# EasyEDA Pro project 步进电机驱动器.eprj, board PCB1.1.2
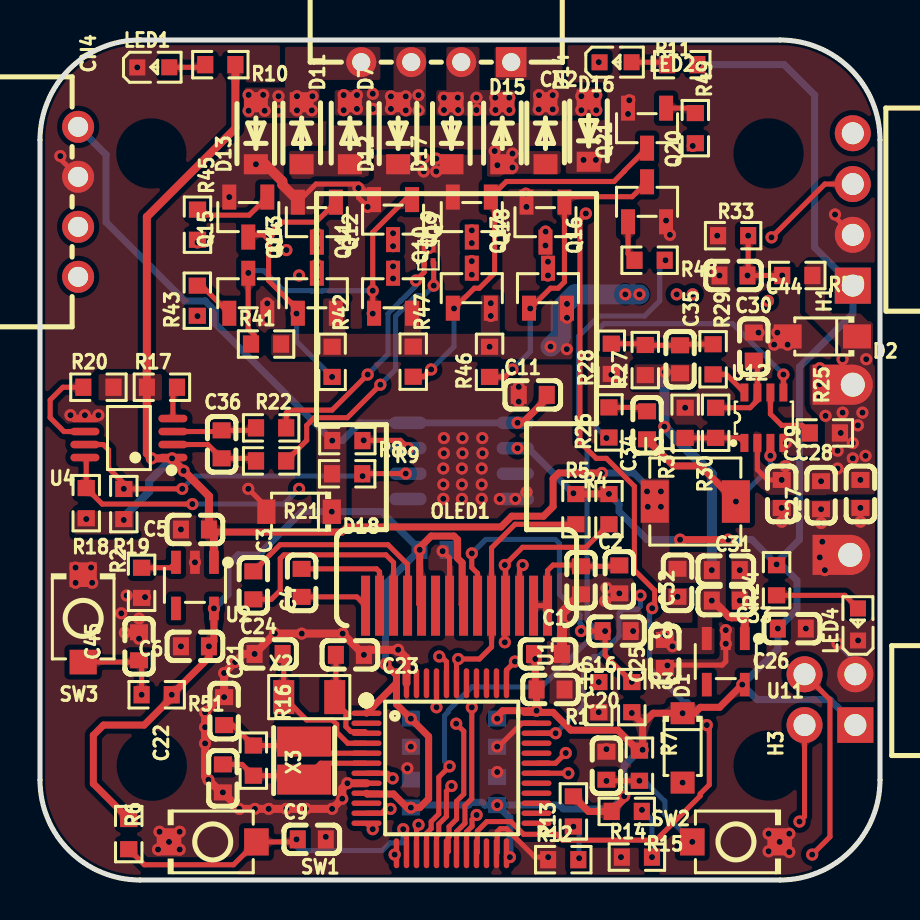
[diagram p4: board, top side]
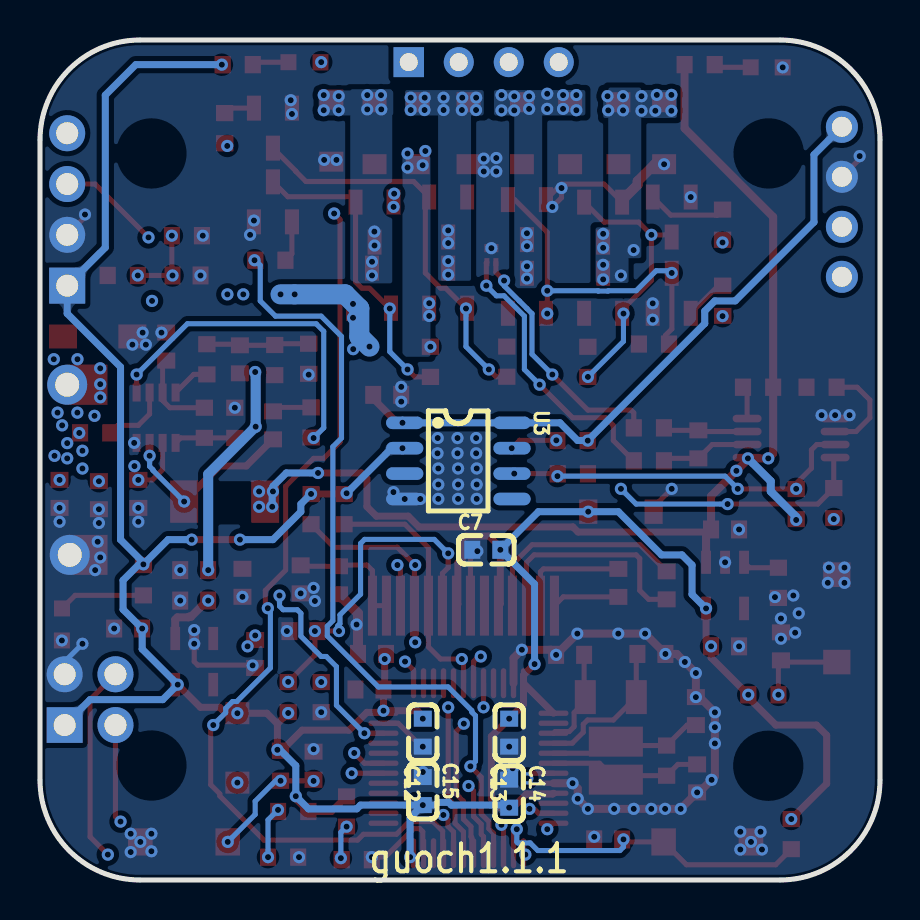
[diagram p5: board, bottom side, seen from below]

Outline 42 x 42 mm; copper layers: Top Layer, Inner1, Inner2, Bottom Layer. Coordinates in mm from the lower left corner of the outline.
Outline path: 0,37 0,5 arc(1.46,1.46) 5,0 37,0 arc(40.54,1.46) 42,5 42,37 arc(40.54,40.54) 37,42 5,42 arc(1.46,40.54) 0,37
Stack: Top Layer 0.035mm 外层铜厚1oz / Dielectric1 0.2104mm 7628 RC49% 8.6mil / Inner1 0.0152mm 内层铜厚 / Dielectric2 1.065mm 1.1mm H/HOZ Copper / Inner2 0.0152mm 内层铜厚 / Dielectric3 0.2104mm 7628 RC49% 8.6mil / Bottom Layer 0.035mm 外层铜厚1oz

## Design rules (mm)
template: 自定义配置
spacing copperThickness1oz (default): track to track 0.102, other pairs 0.152 to 0.3
spacing copperThickness2oz: track to track 0.203, other pairs 0.152 to 0.3
track width copperThickness1oz (default): min 0.127, default 0.254, max 2.54
track width copperThickness2oz: min 0.203, default 0.254, max 2.54
differential pair differentialPair (default): width min 0.127, default 0.254, max 2.54; gap min 0.152, default 0.152
via viaSize (default): diameter min 0.5, default 0.61, max 10; hole min 0.3, default 0.305, max 6.3

## Placement (name value [footprint] x y rotation side)
C1  4.7uF  [C0603]  27.05 14.99 90 top
C2  2.2uF  [C0603]  28.97 15.03 90 top
C3  1uF  [C0603]  10.67 14.73 270 top
C4  1uF  [C0603]  13.08 14.86 270 top
C5  1uF  [C0603]  7.75 17.53 0 top
C6  1uF  [C0603]  7.75 11.68 180 top
C7  1uF  [C0603]  19.69 16.51 180 bottom
C8  10uF  [C0603]  28.83 12.45 0 top
C9  100nF  [C0603]  13.59 2.03 0 top
C10  100nF  [C0603]  28.32 5.72 90 top
C11  1uF  [C0603]  24.64 24.26 0 top
C12  100nF  [C0603]  22.86 7.37 90 bottom
C13  100nF  [C0603]  18.54 7.37 90 bottom
C14  100nF  [C0603]  18.54 4.32 270 bottom
C15  100nF  [C0603]  22.86 4.44 270 bottom
C16  100nF  [C0603]  25.4 11.3 180 top
C20  100nF  [C0603]  25.53 9.53 180 top
C21  12pF  [C0603]  9.21 8.44 270 top
C22  12pF  [C0603]  9.14 5.08 90 top
C23  12pF  [C0603]  15.49 11.26 180 top
C24  12pF  [C0603]  11.43 11.3 0 top
C25  2.2uF  [C0603]  31.24 11.3 90 top
C26  2.2uF  [C0603]  37.59 12.57 180 top
C27  N/A  [C0603]  39.05 19.24 90 top
C28  22uf  [C0603]  41.02 19.3 270 top
C29  0.1uf  [C0603]  37.08 19.3 270 top
C30  0.1uf  [C0603]  35.69 26.67 270 top
C31  22uf  [C0603]  34.29 15.49 0 top
C32  22uf  [C0603]  31.88 14.86 270 top
C33  N/A  [C0603]  34.29 13.97 0 top
C34  0.1u  [C0603]  30.35 22.73 270 top
C35  33pf  [C0603]  32 26.03 270 top
C36  270pF  [C0603]  9.08 21.78 270 top
C44  100nF  [C0603]  34.67 30.23 180 top
C45  100nF  [C0603]  4.95 11.68 90 top
CN2  ZX-XH2.54-4PWZ  [CONN-TH_4P-P2.50_ZX-XH2.54-4PWZ]  19.81 40.89 180 top
CN4  WAFER-XH2.54-4PWZ-Y62  [CONN-TH_4P-P2.50_WAFER-XH2.54-4PWZ]  1.91 33.91 270 top
D1  1N4148W  [SOD-123_L2.7-W1.6-LS3.8-RD]  32.13 6.6 270 top
D2  SMF5.0A  [SOD-123FL_L2.7-W1.8-LS3.8-RD]  39.12 27.18 180 top
D7  PSBD1DF20V3H  [SOD-123F_L2.8-W1.8-LS3.7-RD]  15.49 37.34 270 top
D11  PSBD1DF20V3H  [SOD-123F_L2.8-W1.8-LS3.7-RD]  13.08 37.34 270 top
D12  PSBD1DF20V3H  [SOD-123F_L2.8-W1.8-LS3.7-RD]  17.91 37.34 90 top
D13  PSBD1DF20V3H  [SOD-123F_L2.8-W1.8-LS3.7-RD]  10.79 37.34 90 top
D14  PSBD1DF20V3H  [SOD-123F_L2.8-W1.8-LS3.7-RD]  25.27 37.34 270 top
D15  PSBD1DF20V3H  [SOD-123F_L2.8-W1.8-LS3.7-RD]  23.11 37.34 270 top
D16  PSBD1DF20V3H  [SOD-123F_L2.8-W1.8-LS3.7-RD]  27.43 37.47 90 top
D17  PSBD1DF20V3H  [SOD-123F_L2.8-W1.8-LS3.7-RD]  20.57 37.34 90 top
D18  MMSZ5233BT1G  [SOD-123_L2.7-W1.6-LS3.7-RD]  12.95 18.42 180 top
H1  PZ254R-11-04P  [HDR-TH_4P-P2.54-H-M-W10.4]  40.64 33.53 90 top
H3  PZ254R-12-4P  [HDR-TH_4P-P2.54-H-M-R2-C2-S2.54]  39.5 9.02 90 top
L2  4.7uH  [IND-SMD_L4.4-W4.2]  32.77 18.92 0 top
LED1  -  [LED_0603]  5.72 40.64 0 top
LED2  -  [LED_0603]  28.83 40.89 0 top
LED4  -  [LED_0603]  40.89 12.83 90 top
NOREF  -  [Pad_e104]  40.64 24.77 0 top
NOREF#2  -  [Pad_e107]  39.62 24.77 0 top
NOREF#3  -  [Pad_e106]  40.51 16.26 0 top
NOREF#4  -  [Pad_e108]  39.62 16.26 0 top
OLED1  X049-6432TSWPG02-H14  [OLED-SMD_X049-6432TSWPG02-H14]  20.83 13.72 0 top
Q9  MMBT3906LP  [X1-DFN1006-3_L1.0-W0.6-P0.35-BR]  19.43 31.24 270 top
Q10  BSS84  [SOT-23-3_L2.9-W1.3-P1.90-LS2.4-BR-1]  17.65 29.34 270 top
Q11  BSS84  [SOT-23-3_L2.9-W1.3-P1.90-LS2.4-BR-1]  13.84 29.34 270 top
Q12  2N7002  [SOT-23-3_L2.9-W1.3-P1.90-LS2.4-BR]  17.65 33.02 90 top
Q13  2N7002  [SOT-23-3_L2.9-W1.3-P1.90-LS2.4-BR]  13.84 32.89 90 top
Q14  2N7002  [SOT-23-3_L2.9-W1.3-P1.90-LS2.4-BR]  10.41 29.34 270 top
Q15  2N7002  [SOT-23-3_L2.9-W1.3-P1.90-LS2.4-BR]  10.41 33.15 90 top
Q16  BSS84  [SOT-23-3_L2.9-W1.3-P1.90-LS2.4-BR-1]  25.4 29.59 270 top
Q17  BSS84  [SOT-23-3_L2.9-W1.3-P1.90-LS2.4-BR-1]  21.59 29.59 270 top
Q18  2N7002  [SOT-23-3_L2.9-W1.3-P1.90-LS2.4-BR]  25.27 32.89 90 top
Q19  2N7002  [SOT-23-3_L2.9-W1.3-P1.90-LS2.4-BR]  21.59 33.15 90 top
Q20  2N7002  [SOT-23-3_L2.9-W1.3-P1.90-LS2.4-BR]  30.35 33.91 270 top
Q21  2N7002  [SOT-23-3_L2.9-W1.3-P1.90-LS2.4-BR]  30.35 37.59 90 top
R1  910K  [R0603]  27.94 9.14 90 top
R2  10K  [R0603]  5.08 14.86 90 top
R3  4.7K  [R0603]  29.59 9.14 270 top
R4  4.7K  [R0603]  28.45 18.54 270 top
R5  4.7K  [R0603]  26.8 18.54 270 top
R6  10K  [R0603]  4.44 2.29 270 top
R7  10K  [R0603]  29.97 5.72 270 top
R8  4.7K  [R0603]  15.37 21.97 180 top
R9  4.7K  [R0603]  15.36 20.31 180 top
R10  510R  [R0603]  9.02 40.77 180 top
R11  510R  [R0603]  32.11 40.77 180 top
R12  10K  [R0603]  26.16 1.02 0 top
R13  10K  [R0603]  26.67 3.43 90 top
R14  10K  [R0603]  29.84 1.14 0 top
R15  10K  [R0603]  29.34 3.43 180 top
R16  100M  [R0603]  10.67 5.97 90 top
R17  10K  [R0603]  6.1 24.64 0 top
R18  10K  [R0603]  2.31 18.84 270 top
R19  10K  [R0603]  4.19 18.8 270 top
R20  10K  [R0603]  2.92 24.64 0 top
R21  50  [R0603]  11.56 20.95 180 top
R22  50  [R0603]  11.56 22.61 180 top
R24  4.7K  [R0603]  36.83 14.99 90 top
R25  10K  [R0603]  39.24 22.35 180 top
R26  10R  [R0603]  28.45 22.88 90 top
R27  40.2K  [R0603]  30.26 26 90 top
R28  7.5K  [R0603]  28.57 26.06 90 top
R29  20K  [R0603]  33.66 26.03 270 top
R30  100K  [R0603]  33.78 22.86 90 top
R31  9.09K  [R0603]  32.26 22.86 90 top
R33  20kΩ  [R0603]  34.66 32.22 180 top
R41  10K  [R0603]  11.3 26.8 0 top
R42  10K  [R0603]  14.6 25.91 270 top
R43  1K  [R0603]  7.87 28.96 90 top
R45  1K  [R0603]  7.87 32.77 270 top
R46  10K  [R0603]  22.48 25.91 90 top
R47  10K  [R0603]  18.66 25.92 270 top
R48  1K  [R0603]  30.48 30.99 180 top
R49  1K  [R0603]  32.77 37.59 270 top
R50  200kΩ  [R0603]  37.86 30.23 180 top
R51  10K  [R0603]  5.83 9.26 180 top
SW1  TS-1088-AR02016  [SW-SMD_L3.9-W3.0-P4.45]  8.64 1.91 180 top
SW2  TS-1088-AR02016  [SW-SMD_L3.9-W3.0-P4.45]  34.8 1.91 0 top
SW3  TS-1088-AR02016  [SW-SMD_L3.9-W3.0-P4.45]  2.16 13.08 90 top
U1  STM32F103C8T6  [LQFP-48_L7.0-W7.0-P0.50-LS9.0-BL]  20.57 5.59 270 top
U2  RT9013-33GB  [SOT-23-5_L3.0-W1.7-P0.95-LS2.8-BL]  7.75 14.73 180 top
U3  MT6701CT-STD  [SOP-8_L4.9-W3.9-P1.27-LS6.0-BL]  21.08 20.95 270 bottom
U4  TMP411AQDGKRQ1  [VSSOP-8_L3.0-W3.0-P0.65-LS4.9-BL]  4.44 22.1 90 top
U11  RT9013-33GB  [SOT-23-5_L3.0-W1.7-P0.95-LS2.8-BL]  34.29 10.92 180 top
U12  MP2315SGJ-Z  [TSOT-23-8_L2.9-W1.6-P0.65-LS2.8-BL]  36.19 23.11 0 top
X2  32.768kHz  [CRYSTAL-SMD_L3.2-W1.5-1]  13.46 9.14 0 top
X3  8MHz  [OSC-SMD_2P-L3.2-W2.5]  13.21 5.97 270 top

## Footprints (pads in the part's own frame, mm; a bottom-side part is the same pattern mirrored in y, then rotated)
C0603
  rect 0.8x0.9 smd: 1(-0.7,0) 2(0.7,0)
CONN-TH_4P-P2.50_WAFER-XH2.54-4PWZ
  round 1.6 hole 1: 1(-3.75,0) 2(-1.25,0) 3(1.25,0) 4(3.75,0)
CONN-TH_4P-P2.50_ZX-XH2.54-4PWZ
  rect 1.524x1.5 hole 0.9: 1(-3.75,0)
  round 1.5 hole 0.9: 2(-1.25,0) 3(1.25,0) 4(3.75,0)
CRYSTAL-SMD_L3.2-W1.5-1
  rect 1.05x1.7 smd: 1(-1.275,0) 2(1.275,0)
HDR-TH_4P-P2.54-H-M-R2-C2-S2.54
  rect 1.778x1.8 hole 1.1: 1(-1.27,-1.27)
  round 1.8 hole 1.1: 2(-1.27,1.27) 3(1.27,-1.27) 4(1.27,1.27)
HDR-TH_4P-P2.54-H-M-W10.4
  rect 1.8x1.8 hole 1.1: 1(-3.81,0)
  round 1.8 hole 1.1: 2(-1.27,0) 3(1.27,0) 4(3.81,0)
IND-SMD_L4.4-W4.2
  rect 1.4x2.12 smd: 1(2.028,0) 2(-2.028,0)
LED_0603
  rect 0.8x0.8 smd: 1(-0.851,-0.01) 2(0.75,-0.005)
LQFP-48_L7.0-W7.0-P0.50-LS9.0-BL
  oval 0.27x1.5 smd: 1(-2.75,-4.25) 2(-2.25,-4.25) 3(-1.75,-4.25) 4(-1.25,-4.25) 5(-0.75,-4.25) 6(-0.25,-4.25) 7(0.25,-4.25) 8(0.75,-4.25) 9(1.25,-4.25) 10(1.75,-4.25) 11(2.25,-4.25) 12(2.75,-4.25) 25(2.75,4.25) 26(2.25,4.25) 27(1.75,4.25) 28(1.25,4.25) 29(0.75,4.25) 30(0.25,4.25) 31(-0.25,4.25) 32(-0.75,4.25) 33(-1.25,4.25) 34(-1.75,4.25) 35(-2.25,4.25) 36(-2.75,4.25)
  oval 1.5x0.27 smd: 13(4.25,-2.75) 14(4.25,-2.25) 15(4.25,-1.75) 16(4.25,-1.25) 17(4.25,-0.75) 18(4.25,-0.25) 19(4.25,0.25) 20(4.25,0.75) 21(4.25,1.25) 22(4.25,1.75) 23(4.25,2.25) 24(4.25,2.75) 37(-4.25,2.75) 38(-4.25,2.25) 39(-4.25,1.75) 40(-4.25,1.25) 41(-4.25,0.75) 42(-4.25,0.25) 43(-4.25,-0.25) 44(-4.25,-0.75) 45(-4.25,-1.25) 46(-4.25,-1.75) 47(-4.25,-2.25) 48(-4.25,-2.75)
OLED-SMD_X049-6432TSWPG02-H14
  rect 0.45x3 smd: 1(-4.55,0) 2(-3.85,0) 3(-3.15,0) 4(-2.45,0) 5(-1.75,0) 6(-1.05,0) 7(-0.35,0) 8(0.35,0) 9(1.05,0) 10(1.75,0) 11(2.45,0) 12(3.15,0) 13(3.85,0) 14(4.55,0)
OSC-SMD_2P-L3.2-W2.5
  rect 1.5x2.7 smd: 1(0.95,0) 2(-0.95,0)
Pad_e104
  round 2 hole 1.2: 1(0,0)
Pad_e106
  round 2 hole 1.2: 1(0,0)
Pad_e107
  rect 2x2 smd: 1(0,0)
Pad_e108
  rect 2x2 smd: 1(0,0)
R0603
  rect 0.806x0.864 smd: 1(-0.753,0) 2(0.753,0)
SOD-123_L2.7-W1.6-LS3.7-RD
  rect 0.91x1.22 smd: 1(-1.635,0) 2(1.635,0)
SOD-123_L2.7-W1.6-LS3.8-RD
  rect 1.1x1.2 smd: 1(-1.735,0) 2(1.735,0)
SOD-123F_L2.8-W1.8-LS3.7-RD
  rect 1x1.2 smd: 1(-1.55,0) 2(1.55,0)
SOD-123FL_L2.7-W1.8-LS3.8-RD
  rect 1.4x1.2 smd: 1(-1.735,0) 2(1.735,0)
SOP-8_L4.9-W3.9-P1.27-LS6.0-BL
  oval 0.63x1.865 smd: 1(-1.905,-2.683) 2(-0.635,-2.683) 3(0.635,-2.683) 4(1.905,-2.683) 5(1.905,2.683) 6(0.635,2.683) 7(-0.635,2.683) 8(-1.905,2.683)
SOT-23-3_L2.9-W1.3-P1.90-LS2.4-BR
  rect 1.25x0.7 smd: 1(1,-0.95) 2(1,0.95) 3(-1,0)
SOT-23-3_L2.9-W1.3-P1.90-LS2.4-BR-1
  rect 1.25x0.7 smd: 1(1,-0.95) 2(1,0.95) 3(-1,0)
SOT-23-5_L3.0-W1.7-P0.95-LS2.8-BL
  rect 0.49x1.157 smd: 1(-0.95,-1.153) 2(0,-1.153) 3(0.95,-1.153)
  rect 0.49x1.175 smd: 4(0.95,1.153) 5(-0.95,1.153)
SW-SMD_L3.9-W3.0-P4.45
  rect 1.23x1.36 smd: 1(-2.185,0) 2(2.185,0)
TSOT-23-8_L2.9-W1.6-P0.65-LS2.8-BL
  rect 0.4x0.9 smd: 1(-0.975,-1.26) 2(-0.325,-1.26) 3(0.325,-1.26) 4(0.975,-1.26) 5(0.975,1.26) 6(0.325,1.26) 7(-0.325,1.26) 8(-0.975,1.26)
VSSOP-8_L3.0-W3.0-P0.65-LS4.9-BL
  oval 0.38x1.45 smd: 1(-0.975,-2.2) 2(-0.325,-2.2) 3(0.325,-2.2) 4(0.975,-2.2) 5(0.975,2.2) 6(0.325,2.2) 7(-0.325,2.2) 8(-0.975,2.2)
X1-DFN1006-3_L1.0-W0.6-P0.35-BR
  rect 0.4x0.25 smd: 1(0.35,-0.225) 2(0.35,0.225)
  rect 0.4x0.7 smd: 3(-0.35,0)

## Nets
As in the schematic, except:
12V: C27.2 C28.1 C29.1 D2.1 D7.2 D11.2 D14.2 D15.2 NOREF.1 NOREF#2.1 Q10.2 Q11.2 Q16.2 Q17.2 R25.1 R41.2 R42.1 R46.2 R47.1 R50.1 U12.2
GND: C1.1 C2.1 C5.1 C6.2 C7.1 C8.2 C9.2 C10.2 C11.1 C12.1 C13.1 C14.1 C15.1 C16.1 C20.1 C21.1 C22.1 C23.1 C24.1 C25.1 C26.1 C27.1 C28.2 C29.2 C30.1 C31.2 C32.2 C33.2 C44.2 C45.2 CN4.2 D2.2 D12.1 D13.1 D16.1 D17.1 D18.2 H1.2 H3.3 LED1.1 LED4.1 NOREF#3.1 NOREF#4.1 OLED1.7 Q9.3 Q12.2 Q13.2 Q14.2 Q15.2 Q18.2 Q19.2 Q20.2 Q21.2 R1.1 R2.1 R12.1 R14.1 R28.1 R31.2 R33.2 SW1.2 SW2.2 SW3.2 U1.8 U1.23 U1.35 U1.47 U2.2 U3.4 U4.5 U11.2 U12.4

Pads without a net: OLED1 6; U1 2 10 22 25 26 27 28 29 32 33 38 39 40 41 45 46; U2 4; U3 3 5; U11 4

## Via types
v1: diameter 0.61, hole 0.305, Top Layer to Bottom Layer, 348 vias

## Routing (per net, layer and track width the routed paths; a pad name or vN(x,y) marks a point on that pad's centre or on a via; arc(x,y) is an arc through that point)
12V: length 26.3
  Top Layer w0.254: U12.2 35.87,20.52 36.38,20 v1(37.08,20)
  Inner1 w1: v1(40.13,26.04) 40.64,25.53 NOREF.1 ; v1(29.97,29.28) v1(31.84,29.28) v1(32.63,29.28) 33.07,29.28 33.4,28.96 v1(36.4,28.96) 36.83,28.96 38.99,26.8 v1(38.99,25.58) v1(38.99,24.79) v1(38.99,24.14) 38.99,23.5 v1(39.28,23.21) v1(40.64,21.84)
  Bottom Layer w1: v1(29.97,29.28) v1(29.27,29.28) 26.74,29.28 26.03,28.58 26.03,27.18 v1(25.53,26.67)
  vias: v1(22.54,28.84) v1(22.54,28.2) v1(22.48,26.66) v1(22.73,36.45) v1(22.87,35.74) v1(23.62,36.32) v1(23.62,35.62) v1(26.35,28.8) v1(26.35,28.11) v1(26.34,26.54) v1(37.28,20.69) v1(39.05,19.94) v1(39.88,21.46) v1(39.88,20.57) v1(40.04,22.35) v1(40.13,23.37) v1(40.64,21.08) v1(40.89,22.73) v1(41.02,20) v1(41.12,23.37) v1(41.31,26.04) v1(41.28,21.21)
12V-DET: length 43
  Top Layer w0.254: U1.11 17.08,3.34 17.29,3.56 v1(17.53,3.56) ; v1(37.11,30.23) v1(35.37,30.23) ; 35.41,30.31 v1(35.41,32.22)
  Inner2 w0.254: v1(17.53,3.56) 17.53,3.68 22.87,9.03 22.87,11.16 22.35,11.68 22.35,17.02 23.75,18.42 24.51,18.42 27.43,21.34 27.43,27.56 28.32,28.45 33.47,28.45 35.25,30.23 v1(35.37,30.23)
+5V: length 71.9
  Top Layer w0.35: 8.57,17.4 15.1,17.4 15.35,17.65 23.05,17.65 23.59,18.19 25.18,18.19 25.65,18.67 25.65,20.07 25.94,20.35 v1(28.1,20.35)
  Top Layer w0.4: v1(33.59,13.97) 33.64,13.97 34.44,13.17 34.54,13.17 34.58,13.13 35.13,13.13 35.24,13.02 U11.1 ; U2.1 8.7,17.28 C5.2 8.45,19.19 v1(7.18,20.46) 6.65,21 U4.1 v1(6.6,21.08) v1(5.59,21.08) 5.34,21.33 R17.1 5.34,33.16 9.77,37.58 R10.1
  Bottom Layer w0.35: v1(30.39,18.66) 30.39,19.39 v1(30.35,19.43) 30.35,19.69 29.69,20.35 v1(28.1,20.35)
  Bottom Layer w0.4: 4.19,18.03 4.19,18.16 5.46,19.43 5.46,19.94 v1(6.6,21.08)
  Bottom Layer w0.5: v1(31.24,25.4) 31.22,25.37 v1(31.22,22.67) 33.59,20.29 v1(33.59,15.49)
  vias: v1(2.31,18.05) v1(4.19,18) v1(31.05,19.43) v1(31.05,18.66) v1(31.24,12.23) v1(31.62,11.68)
GND: length 71
  Top Layer w0.254: v1(20.13,16.44) 20.47,16.1 20.47,15.92 20.48,15.92 OLED1.7 ; v1(39.75,33.27) 39.75,33.15 H1.2 ; D18.2 11.32,18.65 v1(10.41,19.56) ; v1(16.38,33.66) 15.93,34.11 v1(15.93,34.6) ; v1(31.37,10.73) 31.38,10.74 34.11,10.74 34.29,10.92 v1(34.29,11.81) ; Q12.2 15.93,34.8 13.8,34.8 Q13.2 ; v1(1.02,36.19) 1.02,36.05 CN4.2 ; U1.23 22.86,1.37 22.86,2.41 23.01,2.56 23.32,2.56 24.74,1.14 v1(25.41,1.14) ; U1.35 24.09,7.84 22.86,6.6
  Top Layer w0.4: U1.8 v1(15.37,4.84) 15.11,4.58 v1(15.11,4.06) v1(14.6,3.56) v1(13.29,3.56) v1(12.31,3.56) v1(11.44,3.56) v1(10.75,3.56) v1(9.97,3.56) v1(9.14,4.38) 9.05,4.38 v1(8.42,5.01) 8.25,5.17 v1(8.25,6.83) v1(8.25,7.64) v1(8.25,8.38) 9.02,9.14 v1(9.21,9.14) v1(9.21,10.35) v1(9.76,10.9) 10.16,11.3 v1(10.73,11.3) v1(11.75,12.32) v1(13.09,12.32) v1(15.13,12.32) v1(16.19,11.26) 16.45,11.51 v1(17.91,11.51) 18.32,11.09 U1.47
  Top Layer w0.5: C1.1 26.1,13.33 C16.1 ; v1(10.79,35.79) 11.27,35.79 12.12,34.94 12.12,34.76 12.89,33.99 Q13.2
  Inner1 w0.254: v1(37.29,21.85) 37.97,21.17 37.97,19.3 37.27,18.6 v1(37.08,18.6) ; v1(27.79,36) 25.44,33.66 v1(24.32,33.66) ; v1(24.29,34.32) 25.49,34.32 v1(27.18,36)
  Bottom Layer w0.254: 40.77,10.29 40.77,10.92 v1(39.88,11.81)
  vias: v1(1.52,23.24) v1(1.78,15.62) v1(1.78,14.86) v1(2.25,23.24) v1(2.55,15.62) v1(2.61,14.86) v1(2.92,23.24) v1(4.06,13.33) v1(4.24,12.36) v1(4.33,14.22) v1(4.86,40.63) v1(4.95,13.07) v1(4.95,12.06) v1(5.25,14.14) v1(5.9,1.52) v1(5.98,2.41) v1(6.45,1.91) v1(7.05,17.53) v1(7.05,11.68) v1(6.99,2.41) v1(6.99,1.52) v1(7.75,15.89) v1(9.46,34.15) v1(11.36,28.83) v1(11.36,28.02) v1(14.29,2.16) v1(18.37,5.59) v1(18.54,6.67) v1(19.19,36.1) v1(19.19,35.43) v1(19.43,31.59) v1(19.81,36.07) v1(19.81,35.43) v1(20.19,22.1) v1(20.19,21.34) v1(20.16,20.58) v1(20.16,19.77) v1(20.16,19.06) v1(21.12,22.1) v1(21.12,21.34) v1(21.1,20.58) v1(21.1,19.77) v1(21.1,19.06) v1(22.11,22.1) v1(22.13,21.34) v1(22.09,20.58) v1(22.09,19.77) v1(22.09,19.06) v1(22.86,6.67) v1(22.86,5.4) v1(22.99,19.05) v1(23.76,19.05) v1(23.94,24.66) v1(23.94,23.92) v1(24.33,19.39) v1(26.17,12.77) v1(27.94,8.39) v1(28.32,14.61) v1(28.26,13.95) v1(28.32,6.54) v1(28.57,25.27) v1(28.97,14.33) v1(29.05,1.14) v1(29.4,38.3) v1(29.46,38.99) v1(29.66,12.45) v1(31.3,32.97) v1(31.5,32.26) v1(31.88,14.16) v1(32.26,23.61) v1(33.86,32.22) v1(33.97,30.23) v1(34.29,12.49) v1(34.99,15.49) v1(34.99,13.97) v1(35.93,27.37) v1(36.43,2.31) v1(36.43,1.44) v1(36.71,26.77) v1(36.87,27.37) v1(36.98,1.91) v1(37.08,17.91) v1(37.38,26.77) v1(37.47,2.31) v1(37.47,1.4) v1(38.29,12.57) v1(38.99,16.13) v1(39.05,18.54) v1(39.05,17.85) v1(39.12,16.91) v1(39.24,15.49) v1(40.91,11.98) v1(41.02,18.6) v1(41.02,17.91)
VCC: length 191
  Top Layer w0.35: v1(24.83,8.46) 24.91,8.38 25.65,8.38 26.54,7.49 28.89,7.49 29.88,6.51 30,6.51 ; v1(24.83,8.46) 24.81,8.46 ; v1(24.83,8.46) C20.2 24.76,9.59 v1(24.76,11.05) ; v1(17.27,10.8) 17.82,10.24 U1.48 ; C11.2 25.34,24.07 24.13,22.86 v1(23.88,22.86) ; v1(4.44,3.05) 2.67,4.82 2.67,7.24 3.18,7.75 5.21,7.75 6.59,9.13 v1(6.59,9.26) 8.45,11.12 v1(8.45,11.68) 8.7,11.93 v1(8.7,13.58) ; U1.9 16.36,4.3 17.68,4.3 18.36,3.62 v1(18.54,3.62) 18.99,3.62 19.43,4.06 19.43,7.18 v1(18.54,8.07) 17.82,8.78 U1.48 ; v1(28.45,19.3) 26.7,19.3 v1(26.67,19.34) ; 30.13,7.81 30.66,8.34 v1(32.13,8.34) 32.72,8.34 33.02,8.64 33.98,8.64 v1(35.11,9.77) ; 30.13,7.81 v1(30.13,6.51) ; 30.13,7.81 v1(29.59,8.35) ; 24.81,8.47 23.13,8.47 22.86,8.19 v1(22.86,8.07) ; OLED1.8 21.11,13.79 21.11,15.86 20.88,16.09 20.88,17.02 20.7,17.2 19.56,17.2 18.99,16.62 v1(18.99,16.51) 18.99,13.81 OLED1.5 ; U1.48 U1.1 ; 29.21,4.06 R15.2 27.42,3.43 R13.2 ; v1(34.42,17.02) v1(32,17.02)
  Bottom Layer w0.35: v1(23.5,1.14) 23.5,3.11 v1(22.86,3.75) ; v1(22.86,3.75) 25.97,3.75 26.16,3.56 28.57,3.56 v1(29.21,4.19) 29.21,5.72 30,6.51 ; v1(22.86,3.75) 22.23,3.75 22.09,3.88 21.57,3.88 21.43,3.75 18.67,3.75 v1(18.54,3.62) ; v1(26.67,19.34) 24.42,21.59 v1(23.88,21.59) ; v1(34.42,17.02) 35.59,17.02 v1(36.83,15.78) ; v1(36.83,15.78) 37.05,15.78 37.85,14.99 37.85,13.53 v1(36.89,12.57) 36.89,11.55 v1(35.11,9.77) 35.86,9.02 39.5,9.02 H3.1 ; v1(36.83,15.78) 36.83,15.88 37.97,17.02 37.97,25.65 40.64,28.32 H1.1 38.74,31.62 38.74,39.24 37.21,40.77 v1(32.91,40.77) ; v1(8.7,13.58) 9.4,14.28 9.4,15.75 9.91,16.26 10.92,16.26 13.08,18.42 v1(14.59,18.42) 17.08,18.42 v1(18.99,16.51) 17.27,14.8 v1(17.27,10.8) ; v1(32,17.02) 30.35,17.02 28.96,18.42 28.96,18.8 v1(28.45,19.3) ; CN4.1 3.3,36.26 3.3,32.89 7.24,28.96 8.25,28.96 8.76,28.45 8.76,27.82 14.61,21.98 ; 14.61,21.98 v1(14.61,21.97) ; 14.61,21.98 15.12,21.98 16,22.86 U3.8 U3.1
A2_USART2_TX: length 27.5
  Top Layer w0.254: U1.12 16.62,2.54 v1(16.64,2.54) ; H3.2 38.23,3.17 v1(37.97,2.92)
  Inner1 w0.254: v1(37.97,2.92) 28.07,2.92 26.87,1.73 18.15,1.73 17.34,2.54 v1(16.64,2.54)
A3_USART2_RX: length 31.4
  Top Layer w0.254: v1(38.61,1.27) 39.5,2.16 39.5,9.02 38.23,10.29
  Inner1 w0.254: v1(38.61,1.27) 37.85,0.51 18.49,0.51 v1(17.73,1.27)
A9_USART1_TX: length 45.7
  Top Layer w0.254: U1.30 v1(26.42,5.34)
  Inner1 w0.254: CN4.3 2.39,32.66 11.81,23.24 11.81,16.51 13.34,14.99 23.11,14.99 27.18,10.92 27.18,6.1 v1(26.42,5.34)
A10_USART1_RX: length 42.6
  Top Layer w0.254: U1.31 25.78,5.84 v1(26.29,6.35)
  Inner1 w0.254: CN4.4 3.37,30.16 11.05,22.48 11.05,15.62 12.19,14.48 22.35,14.48 26.54,10.29 26.54,6.6 v1(26.29,6.35)
A+:
  vias: v1(24.94,38.53) v1(24.95,39.24) v1(25.28,32.42) v1(25.27,31.72) v1(25.4,30.91) v1(25.4,30.23) v1(25.64,39.24) v1(25.64,38.53) v1(27.07,39.19) v1(27.07,38.49) v1(27.81,39.24) v1(27.81,38.49)
A-:
  vias: v1(20.19,39.12) v1(20.2,38.5) v1(20.89,39.12) v1(20.91,38.5) v1(21.59,32.48) v1(21.59,31.85) v1(21.59,30.94) v1(21.59,30.27) v1(21.82,39.12) v1(21.82,38.5) v1(22.76,39.12) v1(22.77,38.5) v1(23.47,39.12) v1(23.47,38.5)
ALARM: length 4.8
  Top Layer w0.254: R20.1 1.14,24.64 0.51,24 0.51,23.11 1.2,22.42 U4.6
B+:
  vias: v1(15.18,39.25) v1(15.18,38.49) v1(15.85,39.25) v1(15.85,38.56) v1(16.64,39.31) v1(16.64,38.56) v1(17.55,39.18) v1(17.55,38.56) v1(17.65,32.34) v1(17.65,31.69) v1(17.65,30.68) v1(17.65,30.07) v1(18.29,39.18) v1(18.29,38.48) v1(18.92,39.24) v1(18.93,38.48)
B-:
  vias: v1(10.43,39.26) v1(10.43,38.46) v1(11.16,39.26) v1(11.23,38.46) v1(11.93,39.19) v1(11.93,38.46) v1(12.32,31.5) v1(12.85,39.19) v1(12.85,38.48) v1(12.95,30.23) v1(13.62,39.19) v1(13.59,38.48) v1(13.84,32.31) v1(13.84,31.61) v1(13.84,30.76) v1(13.84,30.03)
BOOT0: length 15.7
  Top Layer w0.254: U1.44 v1(19.82,8.64)
  Inner1 w0.254: v1(19.82,8.64) 19.82,2.78 19.94,2.67 v1(26.67,2.67)
  Bottom Layer w0.254: R13.1 26.96,2.39 v1(26.96,1.09)
BOOT1: length 13.1
  Top Layer w0.254: U1.20 21.32,2.41 21.6,2.69 21.6,3.02 v1(21.83,3.25)
  Inner1 w0.254: v1(30.1,3.5) 26.68,3.5 26.34,3.16 21.92,3.16 v1(21.83,3.25)
  Bottom Layer w0.254: v1(30.6,1.14) 30.6,3.01 v1(30.1,3.5)
C_SCL: length 45.5
  Top Layer w0.254: v1(7.62,18.8) 3.11,18.8 R18.1 2.31,21.06 U4.8 ; U1.42 20.82,10.96 v1(20.91,11.05) 21.97,11.05 22.58,11.66 OLED1.10 22.58,16.61 23.76,17.79 R5.2 ; v1(16.18,21.98) 18.02,21.98 v1(18.41,21.59)
  Inner1 w0.254: v1(16.18,21.98) 16.01,21.98 13.59,19.56 v1(12.95,19.56)
  Inner2 w0.254: v1(20.91,11.05) 20.91,11.16 20.08,11.99 19.97,11.99 19.26,12.7 18.92,12.7 16.76,14.86 16.76,20.83 16.18,21.41 v1(16.18,21.98)
  Bottom Layer w0.254: v1(7.62,18.8) 12.19,18.8 v1(12.95,19.56)
C_SDA: length 44.3
  Top Layer w0.254: U4.7 3.16,21.77 3.43,21.51 3.43,20.59 4.19,19.83 R19.1 4.2,19.56 v1(7.11,19.56) ; U1.43 20.32,10.92 20.07,11.18 v1(19.96,11.18) ; v1(18.29,20.32) 16.26,20.32 v1(16.13,20.19) ; R4.2 27.3,16.64 24.13,16.64 v1(23.24,15.75) 23.28,15.71 OLED1.11 23.24,13.68 v1(23.24,11.89)
  Inner1 w0.254: v1(23.24,11.89) 22.99,11.63 20.27,11.63 19.96,11.33 v1(19.96,11.18)
  Inner2 w0.254: v1(16.13,20.19) 16.13,14.35 18.16,12.32 19.05,12.32 19.43,11.94 19.43,11.71 v1(19.96,11.18)
  Bottom Layer w0.254: v1(7.11,19.56) 7.75,20.19 v1(16.13,20.19)
  vias: v1(4.19,19.56)
KEY1: length 17.2
  Top Layer w0.254: U1.14 18.32,2.38 v1(18.16,2.54) ; 4.44,1.54 5.22,0.76 9.68,0.76 SW1.1 12.76,1.91 C9.1 v1(12.83,2.03)
  Bottom Layer w0.254: v1(18.16,2.54) 18.16,1.91 18.11,1.85 17.49,1.85 17.11,1.47 13,1.47 12.83,1.65 v1(12.83,2.03)
KEY2: length 17.7
  Top Layer w0.254: v1(29.97,4.96) 28.37,4.96 C10.1 ; v1(18.93,2.76) 18.82,2.66 U1.15
  Inner2 w0.254: v1(18.93,2.76) 19.21,3.05 19.75,3.05 21.04,4.34 27.2,4.34 27.3,4.44 27.43,4.44 27.94,4.95 v1(28.32,4.95)
  Bottom Layer w0.254: v1(29.97,4.96) 30.22,4.96 31.24,3.94 31.24,3.28 v1(32.61,1.91)
LED: length 54.9
  Top Layer w0.254: 30.73,13.72 30.73,14.48 29.72,15.49 29.72,19.69 28.32,21.08 27.81,21.08 27,21.9 27,33.03 v1(27.29,33.33) ; v1(33.34,7.75) 33.46,7.62 33.46,4.76 33.01,4.31 33.01,4.2 30.8,1.99 26.12,1.99 25.83,2.29 24.18,2.29 23.54,2.92 22.34,2.92 21.87,2.44 21.87,1.38 U1.21
  Inner1 w0.254: v1(27.29,33.33) 28.57,34.61 28.57,40.26 v1(27.94,40.89) ; 30.61,13.59 30.73,13.72
  Bottom Layer w0.254: v1(33.34,7.75) 32.72,8.37 32.72,8.58 32.37,8.92 32.16,8.92 30.48,10.6 30.48,13.46 v1(30.61,13.59)
OS_8M_IN: length 7.9
  Top Layer w0.254: U1.5 13.79,6.34 X3.2 13.01,6.72 R16.2 9.65,7.74 C21.2
OS_8M_OUT: length 7.8
  Top Layer w0.254: U1.6 14.03,5.84 13.21,5.02 13.01,5.22 R16.1 10.1,5.78 C22.2
OS_32K_IN: length 5
  Top Layer w0.254: U1.3 16.24,7.42 15.54,7.42 15.29,7.67 15.29,8.37 14.74,8.92 X2.2 14.79,9.2 C23.2
OS_32K_OUT: length 7.5
  Top Layer w0.254: U1.4 15.39,6.84 14.84,7.39 14.84,7.78 14.62,8 13.33,8 12.19,9.14 12.19,11.25 C24.2
PWM1: length 38.8
  Top Layer w0.254: U1.16 19.32,2.33 19.56,2.57 19.56,2.92 19.94,3.3 19.94,5.14 v1(20.48,5.68)
  Bottom Layer w0.254: v1(20.48,5.68) 20.22,5.94 20.22,8.21 20.41,8.39 20.41,8.47 21.59,9.65 25.08,9.65 27.63,12.2 27.63,12.69 27.36,12.97 27.36,21.66 26.92,22.1 26.92,27.18 27.94,28.19 30.23,28.19 30.99,28.96 30.99,30.73 31.24,30.99
  vias: v1(31.28,30.99)
PWM2: length 54.1
  Top Layer w0.254: U1.17 19.82,2.17 19.94,2.29 19.94,2.79 20.32,3.17 20.32,4.44 v1(20.57,4.7)
  Inner2 w0.254: v1(20.57,4.7) 27.05,4.7 28.19,5.84 33.27,5.84 35.81,8.38 35.81,20.07 34.54,21.34 34.54,27.69 35.05,28.19 36.83,28.19 37.9,29.26 37.9,31.82 33.02,36.7 v1(32.64,36.7)
PWM3: length 36.7
  Top Layer w0.254: U1.18 20.41,1.42 20.41,2.12 20.45,2.17 20.45,2.67 20.83,3.04 20.83,3.94 21.19,4.3 21.19,7.44 v1(20.81,7.82)
  Inner2 w0.254: v1(20.81,7.82) 20.81,9.04 20.32,9.53 13.59,9.53 9.21,13.91 9.21,18.61 7.87,19.94 v1(7.87,28.19)
PWM4: length 40.4
  Top Layer w0.254: v1(21.59,8.63) 21.59,4.06 21.25,3.72 21.25,2.83 20.83,2.41 20.83,1.34 U1.19
  Inner2 w0.254: v1(21.59,8.63) 21.61,8.65 21.61,9.01 20.6,10.03 13.99,10.03 12.47,11.55 12.47,12.82 10.18,15.11 10.18,18.92 9.04,20.06 9.04,30.6 7.87,31.77 v1(7.87,31.88)
RST: length 23.6
  Top Layer w0.254: v1(17.63,5.08) 17.38,5.34 U1.7 ; v1(5.08,9.26) 5.08,10.86 C45.1 4.87,10.9 SW3.1
  Inner1 w0.254: v1(17.63,5.08) 17.63,4.68 15.88,2.92 9.27,2.92 7.49,4.7 7.49,6.85 v1(5.08,9.26)
SWCLK: length 35.2
  Top Layer w0.254: H1.3 39.24,34.8 v1(36.58,32.13) ; U1.37 23.32,10.5 v1(23.75,10.92)
  Inner2 w0.254: v1(36.58,32.13) 36.07,31.62 36.07,29.84 34.16,27.94 30.35,27.94 29.46,27.05 29.46,16.89 23.75,11.18 v1(23.75,10.92)
SWDIO: length 44.9
  Top Layer w0.254: U1.34 v1(25.78,7.34)
  Inner1 w0.254: v1(30.02,14.22) 30.02,15.06 29.08,16 29.08,20.19 27.18,22.1 27.18,32.13 28.7,33.66 36.83,33.66 40.51,37.34 H1.4
  Bottom Layer w0.254: v1(25.78,7.34) 27.18,8.73 27.18,10.67 27.69,11.18 27.94,11.18 28.96,12.19 28.96,13.33 29.14,13.51 29.84,13.51 30.02,13.69 v1(30.02,14.22)
$1N769: length 10.6
  Top Layer w0.254: v1(24.13,15.75) 23.98,15.6 OLED1.12
  Inner1 w0.254: v1(27.94,9.9) 27.63,10.2 27.63,14.15 26.03,15.75 v1(24.13,15.75)
$1N873: length 6.2
  Top Layer w0.254: OLED1.13 OLED1.14 25.38,15.47 25.65,15.75 26.99,15.75 C1.2 28.92,15.69 C2.2
$1N957: length 3.4
  Top Layer w0.254: OLED1.1 15.84,14.16 C4.2
$1N962: length 5.6
  Top Layer w0.254: C4.1 16.83,15.56 16.98,15.41 OLED1.2
$1N968: length 11.2
  Top Layer w0.254: OLED1.3 17.68,15.88 17.3,16.26 12.19,16.26 12.01,16.08 12.01,14.48 11.57,14.03 C3.2
$1N973: length 10.7
  Top Layer w0.254: C3.1 12,16.76 17.4,16.76 18.38,15.78 OLED1.4
$1N1238: length 1.8
  Top Layer w0.254: R2.2 6.52,15.61 6.8,15.89
$1N1747: length 22.9
  Top Layer w0.254: OLED1.9 21.88,15.33 21.59,15.62 v1(21.59,16.33) ; v1(27.05,12.45) v1(28.26,12.45) 28.26,11.24 v1(29.59,9.91)
  Inner1 w0.254: v1(32.13,4.87) 30.86,6.14 30.86,8.89 29.84,9.91 v1(29.59,9.91)
  Bottom Layer w0.254: v1(21.59,16.33) 22.29,17.03 25.77,17.03 25.97,16.83 25.97,14.29 27,13.26 27,12.82 27.11,12.7 27.11,12.51 v1(27.05,12.45)
$1N3678: length 1.9
  Top Layer w0.254: LED1.2 8.13,40.64 R10.2
$1N3699: length 1.8
  Top Layer w0.254: 29.58,40.89 31.24,40.89 R11.2
$1N11419: length 1.6
  Top Layer w0.254: U4.4 6.65,24.43 R17.2
$1N11428: length 4.2
  Top Layer w0.254: U4.3 9.02,22.42 C36.1 10.68,22.48 R22.2
$1N11429: length 4.5
  Top Layer w0.254: R21.2 10.68,21.08 C36.2 8.39,21.77 U4.2
$1N11430: length 14.2
  Top Layer w0.254: v1(17.02,24.77) 15.37,23.11 13.72,23.11 13.34,22.73 13.34,21.98 R21.1 ; v1(19.69,29.72) 19.69,30.86 Q9.2
  Bottom Layer w0.254: v1(19.69,29.72) 19.18,29.21 18.8,29.21 17.78,28.19 17.78,25.53 v1(17.02,24.77)
$1N11431: length 12.4
  Top Layer w0.254: Q9.1 19.21,30.38 v1(18.8,29.97) ; v1(16.38,25.27) 14.6,23.5 12.45,23.5 12.31,23.36 R22.1
  Bottom Layer w0.254: v1(16.38,25.27) 17.4,26.29 17.4,28.32 17.65,28.57 17.65,28.58 18.03,28.96 18.04,28.96 18.8,29.71 v1(18.8,29.97)
$1N12162: length 17.3
  Top Layer w0.254: 10.54,30.46 10.41,30.33 10.41,27.55 10.73,27.23 10.73,26.98 R41.1 ; v1(16.64,28.32) v1(16.64,29.46) 16.64,32.39 18.27,34.02 18.6,34.02
  Inner1 w0.254: v1(10.41,30.35) 10.53,30.46 10.54,30.46
  Bottom Layer w0.254: 10.54,30.46 11.19,30.46 12.19,29.46 13.58,29.46 13.6,29.45 14.09,29.45 14.1,29.46 v1(16.64,29.46)
$1N12167: length 13.5
  Top Layer w0.254: v1(11.43,32.26) 11.43,29.97 12.83,28.58 v1(12.83,28.32) ; v1(11.43,32.26) 12.06,32.89 13.79,32.89 Q13.1 ; v1(11.43,32.26) 10.53,32.26 Q15.3
  Bottom Layer w0.254: v1(12.83,28.32) 12.83,26.93 v1(14.6,25.15)
$1N12241: length 2.2
  Top Layer w0.254: R43.2 8.08,29.72 Q14.1
$1N12301: length 4
  Top Layer w0.254: R45.1 8.15,33.24 10.46,33.24 Q15.1
$1N14197: length 15.7
  Top Layer w0.254: v1(23.62,25.53) 23.25,25.15 R46.1 ; Q20.3 29.61,34.16 26.24,34.16 26.22,34.15 26.22,29.91 25.91,29.59 25.53,29.59 v1(24.51,28.58)
  Bottom Layer w0.254: v1(23.62,25.53) 24.51,26.42 v1(24.51,28.58)
$1N14207: length 20
  Top Layer w0.254: v1(19.56,25.53) 19.19,25.16 R47.2 ; Q21.3 29.21,35.45 29.21,35.43 28.7,34.92 23.32,34.92 Q19.1 22.73,33.95 22.73,30.35 21.97,29.59 21.72,29.59 v1(20.7,28.58)
  Bottom Layer w0.254: v1(20.7,28.58) 20.7,26.67 v1(19.56,25.53)
$1N14246: length 2.1
  Top Layer w0.254: R48.2 29.4,31.31 Q20.1
$1N14251: length 1.6
  Top Layer w0.254: Q21.1 32.52,38.59 R49.1
$2N3717: length 3.4
  Top Layer w0.254: U12.6 36.52,23.3 37.08,22.73 38.11,22.73 R25.2
$2N3722: length 4.3
  Top Layer w0.254: R30.2 35.5,23.61 35.87,23.98 U12.7 35.87,25.79 C30.2
$2N3723: length 9.4
  Top Layer w0.254: U12.3 v1(36.52,21.21)
  Top Layer w0.35: v1(34.79,18.92) 33.02,20.7 31.69,20.7 C34.2
  Bottom Layer w0.254: v1(34.79,18.92) 36.35,20.48 36.35,20.52 36.52,20.68 v1(36.52,21.21)
$2N3728: length 17.1
  Top Layer w0.254: R26.1 28.42,22.1 v1(28.32,22.1) ; U12.5 v1(37.17,25.27)
  Bottom Layer w0.254: v1(37.17,25.27) 34.63,27.81 28.19,27.81 27.81,27.43 27.81,22.61 v1(28.32,22.1)
$2N3729: length 2
  Top Layer w0.254: C34.1 30.16,23.63 28.45,23.63
$2N3731: length 1.9
  Top Layer w0.254: U12.8 34.31,25.28 R29.2
$2N3732: length 5.1
  Top Layer w0.254: R28.2 30.2,26.81 R27.2 30.28,26.73 C35.1 32.06,26.79 R29.1
$2N3733: length 3.1
  Top Layer w0.254: R31.1 R30.1 34.97,22.11 U12.1
$2N3742: length 4.3
  Top Layer w0.254: LED4.2 40.24,14.23 R24.1

## Copper pours and planes (outline as drawn; the poured copper is in the pictures)
12V on Top Layer: 18.21,28.96 19.03,28.96 19.06,28.93 19.06,27.04 19.18,26.92 18.16,26.92 18.03,27.05 18.21,27.05
12V on Top Layer: 22.35,36.45 26.03,36.45 26.03,35.18 22.35,35.18
12V on Top Layer: 41.91,25.78 38.48,25.78 38.48,23.77 39.24,23.01 39.24,21.33 38.75,20.83 36.45,20.83 36.45,19.3 41.78,19.3 41.91,19.43
12V on Top Layer: 14.16,27.1 14.16,29.01 14.22,29.08 15.37,29.08 15.27,28.98 15.27,26.81 14.44,26.81
12V on Top Layer: 12.45,36.32 12.45,35.18 12.57,35.31 16,35.31 16,36.32
12V on Top Layer: 26.03,29.21 25.91,29.08 25.91,26.16 26.86,26.16 26.86,29.14 26.8,29.21
12V on Top Layer: 40.04,27.77 40.04,25.02 41.65,25.02 41.65,27.82 41.53,27.94 40,27.94 39.88,27.81 39.93,27.77
12V on Top Layer: 22.35,37.85 24.11,37.85 24.11,35.18 22.35,35.18
12V on Top Layer: 12.45,35.05 16.26,35.05 16.26,36.46 12.45,36.46
12V on Top Layer: 14.6,35.19 14.6,37.72 16.44,37.72 16.44,35.19
12V on Top Layer: 22.05,29.26 22.05,26.74 21.97,26.67 22.86,26.67 22.99,26.8 22.99,29.26
12V on Top Layer: 35.69,19.94 36.09,19.54 36.13,19.54 36.37,19.3 37.67,19.3 37.67,20.63 37.59,20.7 36.4,20.7 36.09,21.01 36.09,22.3 35.99,22.3 35.81,22.48 35.69,22.35
12V on Top Layer: 14.56,37.72 24.06,37.72 24.06,36.52 14.56,36.52
12V on Top Layer: 38.26,30.68 38.26,28.42 40.13,26.54 41.66,26.54 41.53,26.67 41.53,27.81 41.02,28.32 39.62,28.32 39.25,28.7 39.25,30.89 38.47,30.89
12V on Top Layer: 41.97,25.59 38.54,25.59 38.54,23.58 39.31,22.82 39.31,21.14 38.81,20.64 36.51,20.64 36.51,19.11 41.85,19.11 41.97,19.24
12V on Top Layer: 36.45,19.3 36.37,19.3 36.37,19.76 35.69,20.45 35.69,22.39 36.09,22.39 36.09,21.32 36.45,20.95 38.98,20.95 39.36,21.34 39.36,19.24 36.51,19.24
12V on Top Layer: 22.73,27.18 26.8,27.18 26.92,27.05 26.92,26.16 26.8,26.03 23.14,26.03 22.03,27.14 22.7,27.14
12V on Top Layer: 11.56,27.31 23.14,27.31 23.14,26.16 11.68,26.16 11.56,26.29
12V on Bottom Layer: 22.48,36.19 23.88,36.19 23.88,26.16 22.48,26.16
+5V on Top Layer: 29.97,20.07 31.48,20.07 31.48,14.86 29.97,14.86
+5V on Top Layer: 32.99,16.2 34.29,16.2 34.29,13.35 32.99,13.35
+5V on Top Layer: 2.92,25.3 6.1,25.3 6.1,23.98 2.92,23.98
+5V on Top Layer: 29.97,16.4 32.74,16.4 32.74,14.86 29.97,14.86
+5V on Top Layer: 32.88,14.68 33.61,14.68 33.61,11.3 32.88,11.3
+5V on Top Layer: 31.19,16.4 34.29,16.4 34.29,14.86 31.19,14.86
+5V on Top Layer: 30.46,12.6 33.72,12.6 33.72,11.3 30.46,11.3
+5V on Top Layer: 1.86,18.45 4.67,18.45 4.7,18.42 4.7,17.4 4.83,17.27 1.72,17.27 1.72,18.31
+5V on Top Layer: 29.72,25.78 32.64,25.78 32.64,24.64 29.72,24.64
GND on Top Layer: 35.29,27.75 38.04,27.75 38.04,26.67 35.29,26.67
GND on Top Layer: 3.81,14.61 5.97,14.61 5.97,11.68 3.81,11.68
GND on Top Layer: -7.75,49.28 53.85,49.28 53.85,-7.62 -7.75,-7.62
GND on Top Layer: 26.59,14.99 29.59,14.99 29.59,13.73 26.59,13.73
GND on Top Layer: 38.61,18.62 41.73,18.62 41.73,15.24 38.61,15.24
GND on Top Layer: 19.81,36.31 21.13,36.31 21.13,33.53 19.81,33.53
GND on Top Layer: 17.4,36.32 21.21,36.32 21.21,35.18 17.4,35.18
GND on Top Layer: 25.65,11.81 26.83,11.81 26.83,8.91 25.65,8.91
GND on Top Layer: 36.37,19.02 41.78,19.02 41.78,17.27 36.37,17.27
GND on Bottom Layer: 17.91,7.09 19.25,7.09 19.25,4.6 17.91,4.6
GND on Bottom Layer: 22.15,7.09 23.5,7.09 23.5,4.7 22.15,4.7
GND on Bottom Layer: -4.06,46.1 49.02,46.1 49.02,-2.67 -4.06,-2.67
GND on Inner1: -4.57,50.04 46.74,50.04 46.74,-4.83 -4.57,-4.83
GND on Inner2: -2.92,46.36 44.96,46.36 44.96,-4.95 -2.92,-4.95
VCC on Top Layer: 13.83,22.77 15.33,22.77 15.33,17.52 13.83,17.52
A+ on Top Layer: 22.73,41.66 26.03,41.66 26.03,40 22.73,40
A+ on Top Layer: 24.51,39.62 28.07,39.62 28.07,38.23 24.51,38.23
A+ on Top Layer: 24.51,41.64 26.12,41.64 26.12,38.23 24.51,38.23
A+ on Bottom Layer: 24.39,39.54 26.49,39.54 26.49,29.83 24.39,29.83
A+ on Bottom Layer: 24.34,39.47 28.07,39.47 28.07,38.23 24.34,38.23
A- on Top Layer: 19.81,39.5 23.75,39.5 23.75,38.23 19.81,38.23
A- on Top Layer: 20.32,41.66 21.97,41.66 21.97,38.35 20.32,38.35
A- on Bottom Layer: 20.45,39.43 22.1,39.43 22.1,29.96 20.45,29.96
A- on Bottom Layer: 19.81,39.5 23.75,39.5 23.75,38.23 19.81,38.23
B+ on Top Layer: 14.73,39.5 18.67,39.5 18.67,38.23 14.73,38.23
B+ on Top Layer: 17.68,41.66 19.3,41.66 19.3,38.23 17.68,38.23
B+ on Bottom Layer: 16.89,39.39 18.29,39.39 18.29,29.59 16.89,29.59
B+ on Bottom Layer: 14.73,39.5 19.3,39.5 19.3,38.23 14.73,38.23
B- on Top Layer: 12.25,41.66 17.02,41.66 17.02,40 12.25,40
B- on Top Layer: 10.03,39.62 13.84,39.62 13.84,38.1 10.03,38.1
B- on Top Layer: 12.25,41.66 13.97,41.66 13.97,38.1 12.25,38.1
B- on Top Layer: 10.16,39.5 13.72,39.5 13.72,38.35 10.16,38.35
B- on Bottom Layer: 10.16,39.5 13.84,39.5 13.84,38.1 10.16,38.1
B- on Bottom Layer: 11.94,39.62 13.59,39.62 13.59,31.09 11.94,31.09
B- on Bottom Layer: 12.57,32.64 14.22,32.64 14.22,29.84 12.57,29.84

Small or netless copper shapes (teardrops, artwork), in the pictures only: 346 on Top Layer, 88 on Bottom Layer, 28 on Inner1, 13 on Inner2

## Text on the board
Bottom Silkscreen Layer: guoch1.1.1
